# Altium schematic sheet DVL.SchDoc
size A
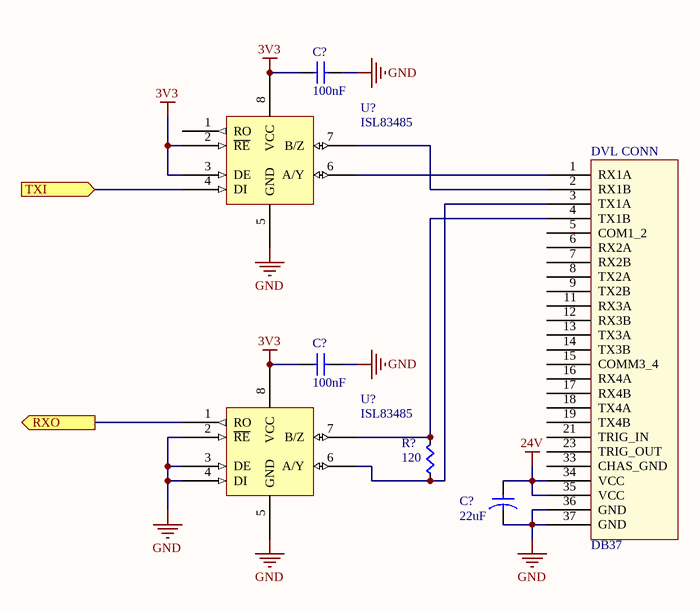
[diagram p0: DVL.SchDoc]

## Parts
(Parts that share a designator on the sheet are numbered #1, #2 ... from top to bottom, then left to right.)
C?#1  value 100nF  [CAPC0603]  (hidden comment: Cap)
C?#2  value 100nF  [CAPC0603]  (hidden comment: Cap)
C?#3  value 22uF  [CAP22uF100V]  (hidden comment: CapPol)
DVL_CONN  DB37  [DSUB37_ FEMALE]
R?  value 120  [RES0603]  (hidden comment: Res)
U?#1  ISL83485  [ISL8348xIBZ]
U?#2  ISL83485  [ISL8348xIBZ]

## Ports
RXO (out), TXI (in)

## Nets
3V3: C?#1.1(A) C?#2.1(A) U?#1.2(~{RE}) U?#1.3(DE) U?#1.8(VCC) U?#2.8(VCC)
24V: C?#3.1(A) DVL_CONN.34(VCC) DVL_CONN.35(VCC)
GND: C?#1.2(B) C?#2.2(B) C?#3.2(B) DVL_CONN.36(GND) DVL_CONN.37(GND) U?#1.5(GND) U?#2.2(~{RE}) U?#2.3(DE) U?#2.4(DI) U?#2.5(GND)
RXO: U?#2.1(RO) ; port RXO
TXI: U?#1.4(DI) ; port TXI
NetDVL_CONN_1: DVL_CONN.1(RX1A) U?#1.6(A/Y)
NetDVL_CONN_2: DVL_CONN.2(RX1B) U?#1.7(B/Z)
NetDVL_CONN_3: DVL_CONN.3(TX1A) R?.2(B) U?#2.6(A/Y)
NetDVL_CONN_4: DVL_CONN.4(TX1B) R?.1(A) U?#2.7(B/Z)

Not connected (* = marked no-connect by the designer): DVL_CONN 5(COM1_2) 6(RX2A) 7(RX2B) 8(TX2A) 9(TX2B) 11(RX3A) 12(RX3B) 13(TX3A) 14(TX3B) 15(COMM3_4) 16(RX4A) 17(RX4B) 18(TX4A) 19(TX4B) 21(TRIG_IN) 23(TRIG_OUT) 33(CHAS_GND); U?#1 1(RO)

## Library data of the parts
DVL_CONN = DVLCONN: DVL Connector using DSUB37; Manufacturer: FCI; Manufacturer Part Number: 10090098-S374VLF; Supplier 1: Digikey; Supplier Part Number 1: 609-4001-ND
U?#1 U?#2 = ISL83485: 3.3V RS485 Transceiver; Supplier 1: Digi-Key; Supplier Part Number 1: ISL83485IBZ-ND
C?#1 C?#2 = Cap: Supplier 1: Digi-Key; Supplier Part Number 1: 1276-1000-1-ND
C?#3 = CapPol: Supplier 1: Digi-Key; Supplier Part Number 1: P5310-ND
R? = Res: Supplier 1: Digi-Key; Supplier Part Number 1: RMCF0603JT10K0CT-ND